# Altium schematic sheet 400ETB.SchDoc
size Tabloid
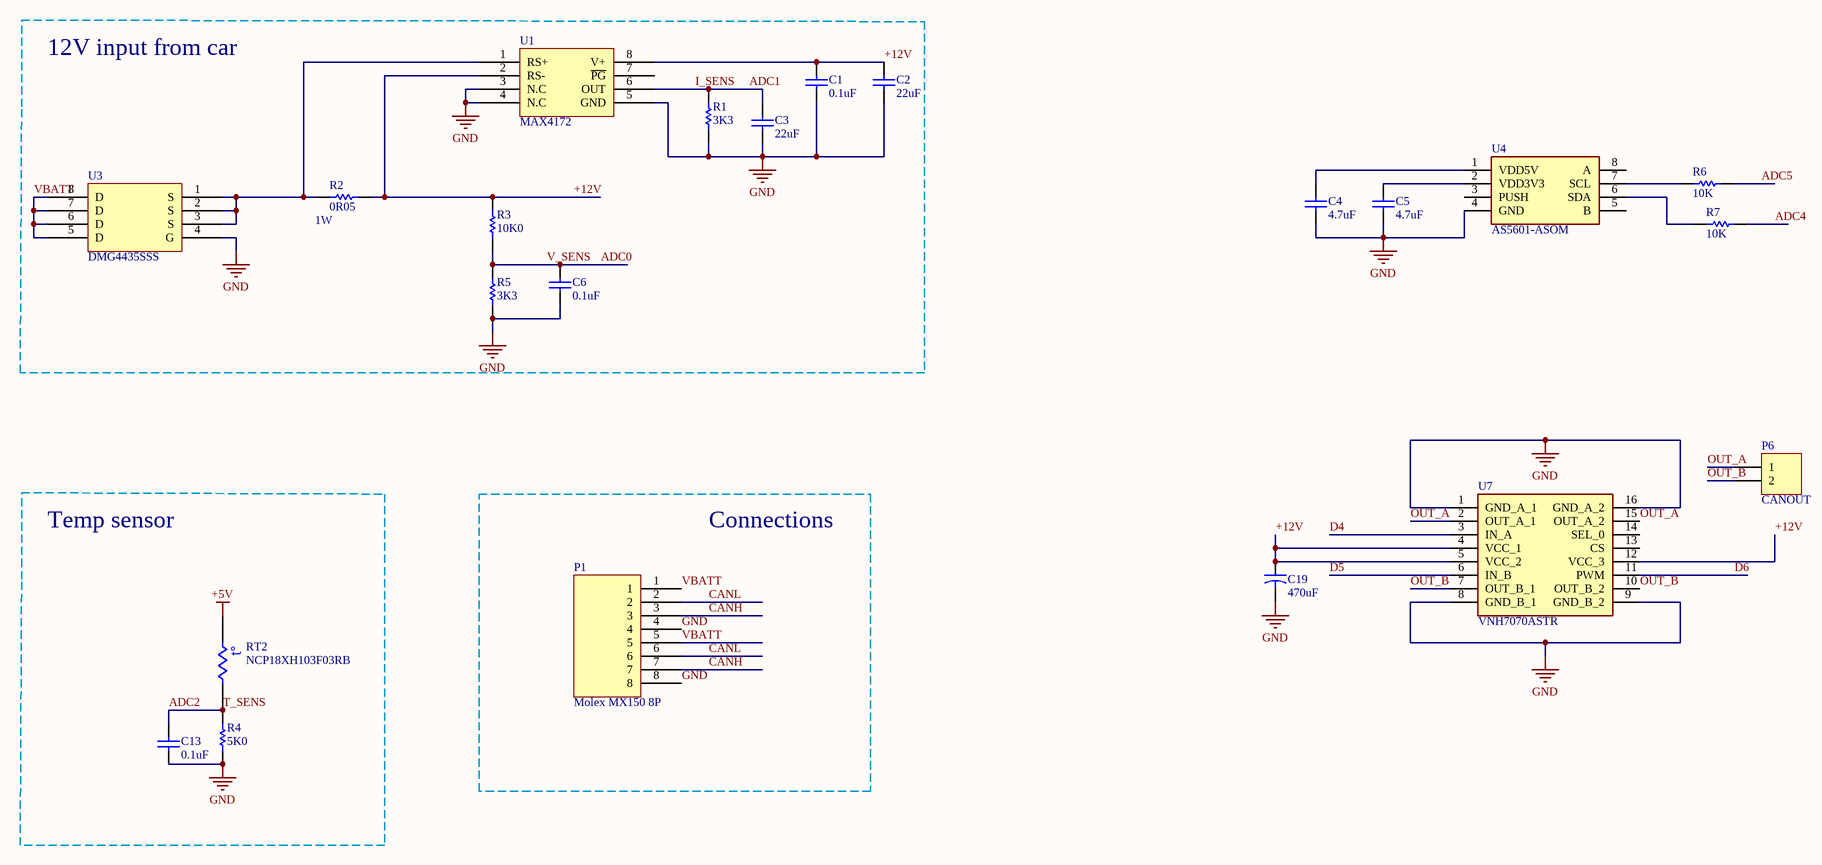
[diagram p0: 400ETB.SchDoc]

## Parts
C1  0.1uF  [C0603]
C2  22uF  [C1206]
C3  22uF  [C1206]
C4  4.7uF  [CAPC3216X170N]
C5  4.7uF  [CAPC3216X170N]
C6  0.1uF  [C0603]
C13  0.1uF  [C0603]
C19  470uF  [CAP THRU 10MM]
P1  Molex MX150 8P  [MX150 8-Pin]
P6  CANOUT  [Pin Header 1x2 TH Pitch 2.54mm]
R1  3K3  [R0603]
R2  0R05  Power: 1W  [R1206]
R3  10K0  [R0603]
R4  5K0  [R0603]
R5  3K3  [R0603]
R6  10K  [RESC3216X60N]
R7  10K  [RESC3216X60N]
RT2  NCP18XH103F03RB  [R0603]
U1  MAX4172  [SOIC-8]
U3  DMG4435SSS  [SOIC-8]
U4  AS5601-ASOM  [SOIC127P600X175-8N]
U7  VNH7070ASTR  [SOIC127P600X175-16N]

## Blocks framed on the sheet
12V input from car: C1-C3 C6 R1-R3 R5 U1 U3
Temp sensor: C13 R4 RT2
Connections: P1

## Nets
+5V: RT2.1
GND: C1.1 C2.1 C3.1 C4.1 C5.1 C6.1 C13.1 C19.2 P1.4 P1.8 R1.1 R4.1 R5.1 U1.3(N.C) U1.4(N.C) U1.5(GND) U3.4(G) U4.4(GND) U7.1(GND_A_1) U7.8(GND_B_1) U7.9(GND_B_2) U7.16(GND_A_2)
+12V: C1.2 C2.2 C19.1 R2.2 R3.2 U1.2(RS-) U1.8(V+) U7.4(VCC_1) U7.5(VCC_2) U7.12(VCC_3)
ADC0: C6.2 R3.1 R5.2  [also labelled V_SENS]
ADC1: C3.2 R1.2 U1.6(OUT)  [also labelled I_SENS]
ADC2: C13.2 R4.2 RT2.2  [also labelled T_SENS]
ADC4: R7.2
ADC5: R6.2
CANH: P1.3 P1.7
CANL: P1.2 P1.6
D4: U7.3(IN_A)
D5: U7.6(IN_B)
D6: U7.11(PWM)
OUT_A: P6.1 U7.2(OUT_A_1) U7.15(OUT_A_2)
OUT_B: P6.2 U7.7(OUT_B_1) U7.10(OUT_B_2)
VBATT: P1.1 P1.5 U3.5(D) U3.6(D) U3.7(D) U3.8(D)
NetC4_2: C4.2 U4.1(VDD5V)
NetC5_2: C5.2 U4.2(VDD3V3)
NetR2_1: R2.1 U1.1(RS+) U3.1(S) U3.2(S) U3.3(S)
NetR6_1: R6.1 U4.7(SCL)
NetR7_1: R7.1 U4.6(SDA)

Not connected (* = marked no-connect by the designer): U1 7(~{PG}); U4 3(PUSH) 5(B) 8(A); U7 13(CS) 14(SEL_0)

## Notes on the sheet
- Title
- Size:
- Date:
- Tabloid
- Number:
- Time:
- Revision:
- Sheet
- of
- File:
- (in symbol Res Thermal) t°

## Library data of the parts
C1-C3 C6 C13 = Cap: Capacitor; Value: 100pF; Published: 8-Jun-2000; LatestRevisionDate: 17-Jul-2002; LatestRevisionNote: Re-released for DXP Platform.; PackageReference: RAD-0.3; Publisher: Altium Limited; PackageDescription: Radial Cap, Thru-Hole; 2 Leads; 0.3 in Pin Spacing
C4 C5 = Cap Semi: Capacitor (Semiconductor SIM Model); Manufacturer: Murata; Manufacturer Part Number: GRM31MR71H105KA88L; Material: Ceramic; Tolerance: 10%; Voltage Rating: 50V; Capacitance: 1uF; Dielectric: X7R; Published: 8-Jun-2000; LatestRevisionDate: 29-May-2009; LatestRevisionNote: IPC-7351 Footprint Added.; PackageReference: C1206; Publisher: Altium Limited; PackageDescription: Chip Capacitor; Value: 4.7uF; Supplier 1: Digi-Key; Stock 1: 0; Mount: Surface Mount; Case/Package: 1206; Number of Pins: 2; Case Code (Metric): 3216; Case Code (Imperial): 1206; Min Operating Temperature: -55°C; Max Operating Temperature: 125°C; Package Quantity: 1; Packaging: Tape and Reel; Voltage Rating (DC): 50V; Termination: SMD/SMT; Voltage: 50V; Length: 3.2mm; Height: 1.15mm; Width: 0.063inch; Thickness: 0.049inch; Depth: 1.6mm; REACH SVHC: No SVHC; Lead Free: Lead Free; ComponentLink1URL: https://datasheet.ciiva.com/16379/product-16379616.pdf; ComponentLink1Description: https://datasheet.ciiva.com/16379/product-16379616.pdf; ComponentLink2URL: https://datasheet.ciiva.com/14116/nmgrm-data-en-14116709.pdf; ComponentLink2Description: https://datasheet.ciiva.com/14116/nmgrm-data-en-14116709.pdf; ComponentLink3URL: https://datasheet.ciiva.com/22703/608985-22703384.pdf; ComponentLink3Description: https://datasheet.ciiva.com/22703/608985-22703384.pdf; ComponentLink4URL: https://datasheet.ciiva.com/3777/42grm31mr71h105ka8823-3777081.pdf; ComponentLink4Description: https://datasheet.ciiva.com/3777/42grm31mr71h105ka8823-3777081.pdf; ComponentLink5URL: https://datasheet.ciiva.com/6270/partnumbering-e-01-6270398.pdf; ComponentLink5Description: https://datasheet.ciiva.com/6270/partnumbering-e-01-6270398.pdf; ComponentLink6URL: https://datasheet.ciiva.com/6270/partnumbering-e-01-6270399.pdf; ComponentLink6Description: https://datasheet.ciiva.com/6270/partnumbering-e-01-6270399.pdf; ComponentLink7URL: https://datasheet.ciiva.com/29199/455056-da-01-en-vs-kondensator-1206-29199449.pdf; ComponentLink7Description: https://datasheet.ciiva.com/29199/455056-da-01-en-vs-kondensator-1206-29199449.pdf; ComponentLink8URL: https://datasheet.ciiva.com/29202/450923-da-01-de-vs-chip-kond-1206-1-0-uf-10pr-50-0v-x7r-29202718.pdf; ComponentLink8Description: https://datasheet.ciiva.com/29202/450923-da-01-de-vs-chip-kond-1206-1-0-uf-10pr-50-0v-x7r-29202718.pdf; Supplier 2: Digi-Key; Supplier Part Number: 1276-1055-1-ND
C19 = Cap2: Capacitor; Value: 100pF; Published: 23-Sep-2002; PackageReference: CAPR5-4X5; Publisher: Altium Limited; PackageDescription: Capacitor; 2 Leads
P6 = Header 2: Header, 2-Pin; LatestRevisionDate: 17-Jul-2002; LatestRevisionNote: Re-released for DXP Platform.; Publisher: Altium Limited
R1-R3 R5 = Res1: Resistor; Value: 1K; Published: 8-Jun-2000; LatestRevisionDate: 17-Jul-2002; LatestRevisionNote: Re-released for DXP Platform.; PackageReference: AXIAL-0.3; Publisher: Altium Limited; PackageDescription: Axial Device, Thru-Hole; 2 Leads; 0.3 in Pin Spacing
R4 = Res1: Resistor; Value: 10K; Published: 8-Jun-2000; LatestRevisionDate: 17-Jul-2002; LatestRevisionNote: Re-released for DXP Platform.; PackageReference: AXIAL-0.3; Publisher: Altium Limited; PackageDescription: Axial Device, Thru-Hole; 2 Leads; 0.3 in Pin Spacing
R6 R7 = Res1: Resistor; Manufacturer: Stackpole Electronics; Manufacturer Part Number: RNCP1206FTD1K00; Resistance: 10kR; Tolerance: 1%; Temperature Coefficient: 100ppm/°C; Max Power Dissipation: 500mW; Value: 10K; Supplier Part Number: RNCP1206FTD10K0CT-ND; Supplier 1: Digi-Key; Stock 1: 679; Pricing 1: 1=0.1, 10=0.052, 100=0.0211, 1000=0.00949, 2500=0.00824 (USD); Mount: Surface Mount; Case/Package: 1206; Case Code (Metric): 3216; Case Code (Imperial): 1206; Contact Plating: Nickel,Tin,Matte; Min Operating Temperature: -55°C; Max Operating Temperature: 155°C; Packaging: Tape and Reel; Composition: Thin Film; Number of Terminations: 2; Length: 0.122inch; Height: 0.024inch; Width: 0.059inch; Radiation Hardening: No; Lead Free: Lead Free; ComponentLink1URL: http://www.seielect.com/Catalog/SEI-rncp.pdf; ComponentLink1Description: http://www.seielect.com/Catalog/SEI-rncp.pdf; ComponentLink2URL: https://www.seielect.com/catalog/SEI-Packaging.pdf; ComponentLink2Description: https://www.seielect.com/catalog/SEI-Packaging.pdf
RT2 = Res Thermal: Thermistor; Published: 24-Mar-1999; LatestRevisionDate: 29-May-2009; LatestRevisionNote: IPC-7351 Footprint Added.; PackageVersion: Mar-2003; PackageReference: 6-0805; Publisher: Altium Limited; PackageDescription: Chip Resistor 0805 Case Size; Code_IPC: RESC2012
U1 = MAX4172: SOIC
U3 = DMG4435SSS: SOIC
U4 = AS5601-ASOM: Integrated Circuit; Manufacturer_Name: ams; Datasheet Link: http://ams.com/eng/content/download/659003/1738497/343455.pdf; Height: 1.75mm; Manufacturer_Part_Number: AS5601-ASOM; Mouser Part Number: 985-AS5601-ASOM; Mouser Price/Stock: https://www.mouser.com/Search/Refine.aspx?Keyword=985-AS5601-ASOM; RS Part Number: 1024168P; RS Price/Stock: http://uk.rs-online.com/web/p/products/1024168P
U7 = VNH7070ASTR: Integrated Circuit; Manufacturer_Name: STMicroelectronics; Datasheet Link: http://www.st.com/content/ccc/resource/technical/document/datasheet/08/97/0a/0c/cf/4b/41/40/DM00213876.pdf/files/DM00213876.pdf/jcr:content/translations/en.DM00213876.pdf; Height: 1.75mm; Manufacturer_Part_Number: VNH7070ASTR; Mouser Part Number: 511-VNH7070ASTR; Mouser Price/Stock: https://www.mouser.com/Search/Refine.aspx?Keyword=511-VNH7070ASTR; RS Part Number: 1647017P; RS Price/Stock: http://uk.rs-online.com/web/p/products/1647017P